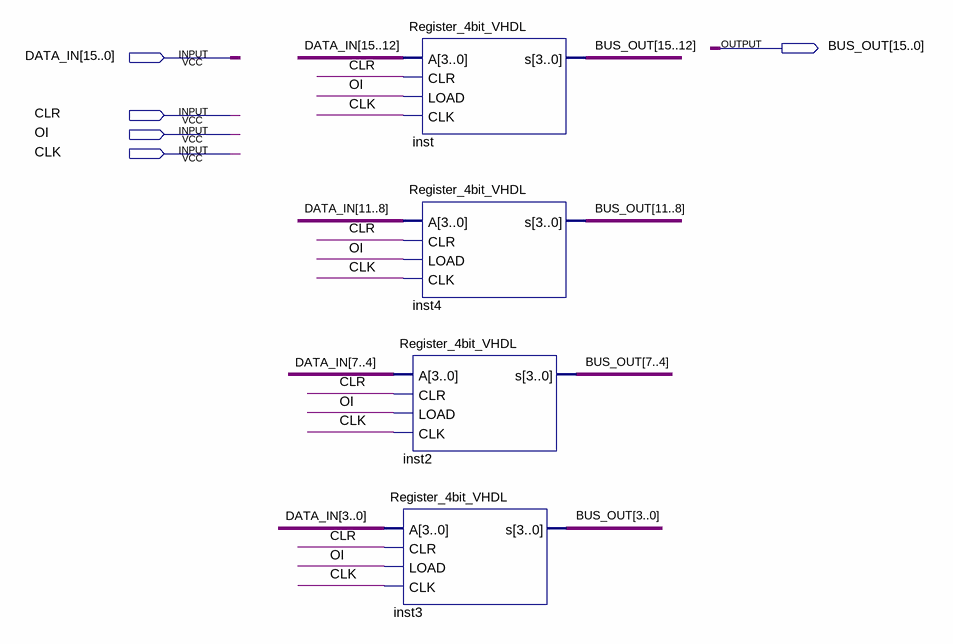
[diagram p0: schematic sheet]
// Quartus schematic OutputReg_16bit.bdf as structural Verilog: 4 symbols, 5 pins
module OutputReg_16bit (
  input  [15:0] DATA_IN,
  input  CLR,
  input  OI,
  input  CLK,
  output [15:0] BUS_OUT
);

  Register_4bit_VHDL inst (.A(DATA_IN[15:12]), .CLR(CLR), .LOAD(OI), .CLK(CLK), .s(BUS_OUT[15:12]));
  Register_4bit_VHDL inst4 (.A(DATA_IN[11:8]), .CLR(CLR), .LOAD(OI), .CLK(CLK), .s(BUS_OUT[11:8]));
  Register_4bit_VHDL inst2 (.A(DATA_IN[7:4]), .CLR(CLR), .LOAD(OI), .CLK(CLK), .s(BUS_OUT[7:4]));
  Register_4bit_VHDL inst3 (.A(DATA_IN[3:0]), .CLR(CLR), .LOAD(OI), .CLK(CLK), .s(BUS_OUT[3:0]));
endmodule
